# EAGLE design bela_cape (EAGLE 6.5.0)

## Sheet 1 of 4
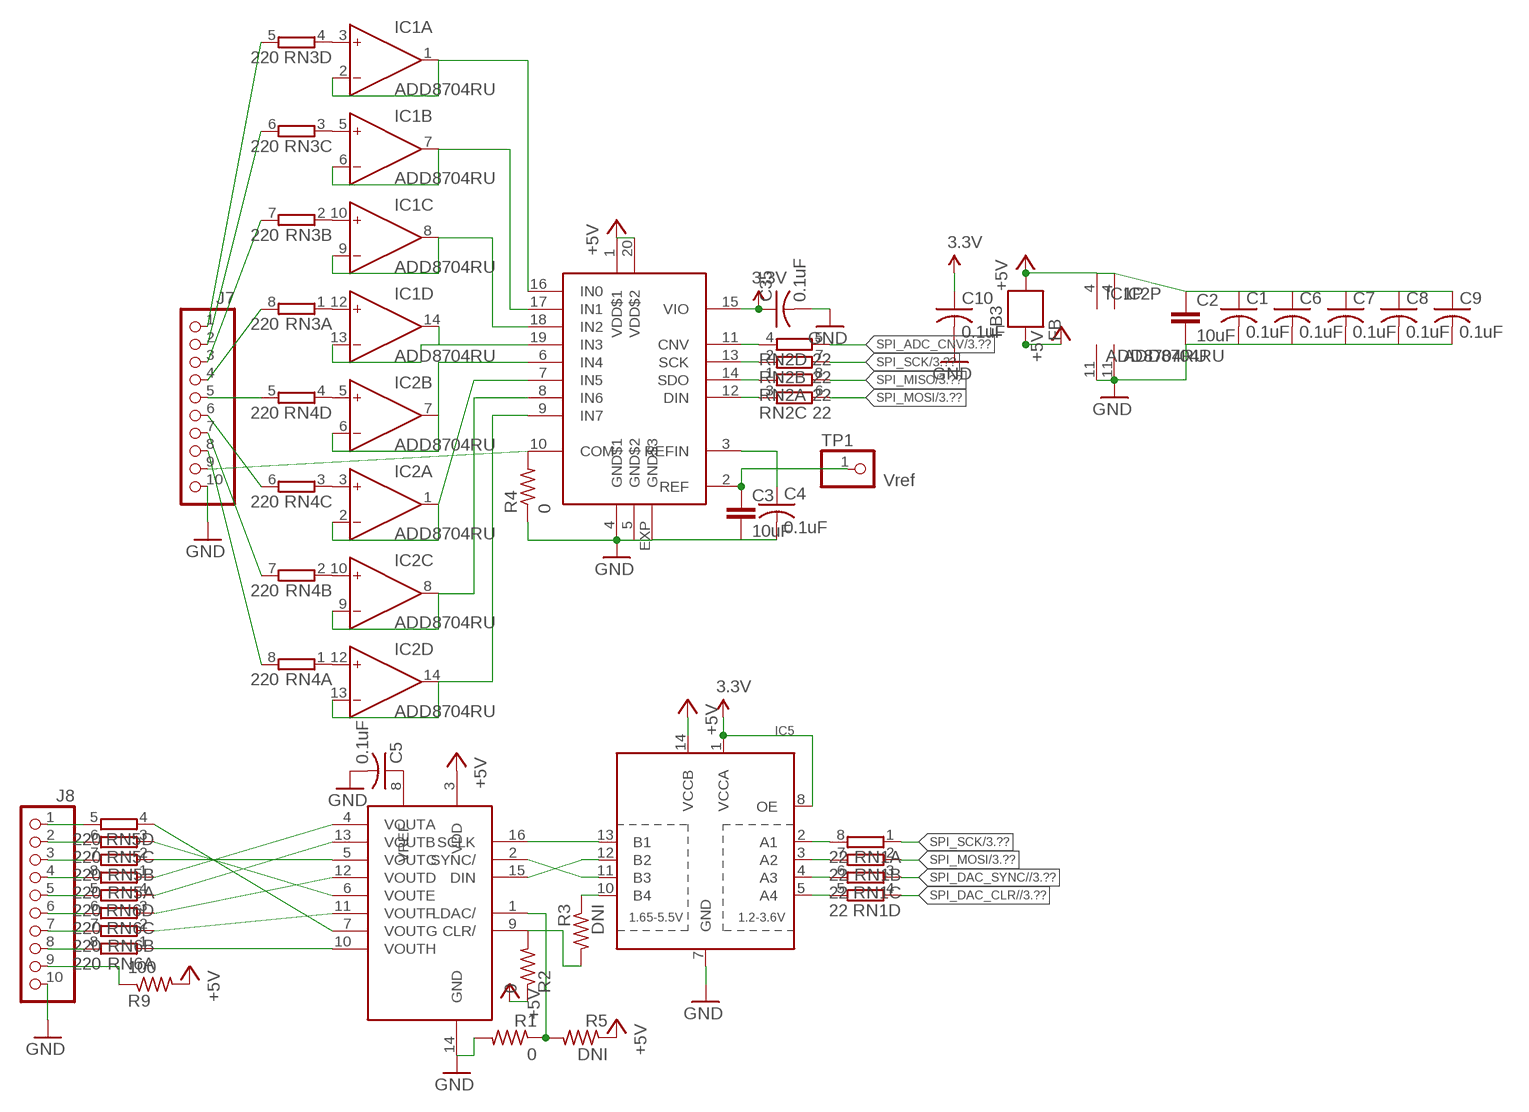
[diagram p0: schematic, sheet 1]

### Parts
C1  0.1uF  C-USC0603  [C0603]
C2  10uF  CAP0603-CAP  [0603-CAP]
C3  10uF  CAP0603-CAP  [0603-CAP]
C4  0.1uF  C-USC0603  [C0603]
C5  0.1uF  C-USC0603  [C0603]
C6  0.1uF  C-USC0603  [C0603]
C7  0.1uF  C-USC0603  [C0603]
C8  0.1uF  C-USC0603  [C0603]
C9  0.1uF  C-USC0603  [C0603]
C10  0.1uF  C-USC0603  [C0603]
C35  0.1uF  C-USC0603  [C0603]
FB3  FB  [0603]
IC1  ADD8704RU  [TSSOP14]
IC2  ADD8704RU  [TSSOP14]
IC3  AD5668  [TSSOP16-PW]
IC4  AD7699  [LFCSP20-LEADS]
IC5  TXB0104PWR  [TSSOP14]
J7  PINHD-1X10  [1X10]
J8  PINHD-1X10  [1X10]
R1  0  R-US_R0603  [R0603]
R2  0  R-US_R0603  [R0603]
R3  DNI  R-US_R0603  [R0603]
R4  0  R-US_R0603  [R0603]
R5  DNI  R-US_R0603  [R0603]
R9  100  R-US_R0603  [R0603]
RN1  22  4R-N0603-ARC  [0603-ARC]
RN2  22  4R-N0603-ARC  [0603-ARC]
RN3  220  4R-N0603-ARC  [0603-ARC]
RN4  220  4R-N0603-ARC  [0603-ARC]
RN5  220  4R-N0603-ARC  [0603-ARC]
RN6  220  4R-N0603-ARC  [0603-ARC]
TP1  PINHD-1X1  [1X01]

### Nets
3.3V: C10.1 C35.1 IC4.15(VIO) IC5.1(VCCA) IC5.8(OE) ; also sheet 3,4
+5V_ADC_DAC: C1.1 C2.1 C6.1 C7.1 C8.1 C9.1 FB3.1 IC1.4(P:V+) IC2.4(P:V+) IC3.3(VDD) IC4.1(VDD$1) IC4.20(VDD$2) IC5.14(VCCB) R2.1 R5.1 R9.2 ; supply symbol labelled +5V
+5V_SYS: FB3.2 ; supply symbol labelled +5V ; also sheet 3
DGND: C1.2 C2.2 C3.2 C4.2 C5.2 C6.2 C7.2 C8.2 C9.2 C10.2 C35.2 IC1.11(P:V-) IC2.11(P:V-) IC3.14(GND) IC4.4(GND$1) IC4.5(GND$2) IC4.EXP(GND$3) IC5.7(GND) J7.10 J8.10 R1.2 R4.1 ; supply symbol labelled GND ; also sheet 3,4
N$1: IC3.16(SCLK) IC5.13(B1)
N$2: IC3.15(DIN) IC5.12(B2)
N$3: IC3.2(SYNC/) IC5.11(B3)
N$4: IC3.9(CLR/) R2.2 R3.2
N$5: IC1.1(A:OUT) IC1.2(A:IN-) IC4.16(IN0)
N$6: IC1.6(B:IN-) IC1.7(B:OUT) IC4.17(IN1)
N$7: IC1.8(C:OUT) IC1.9(C:IN-) IC4.18(IN2)
N$8: IC1.13(D:IN-) IC1.14(D:OUT) IC4.19(IN3)
N$9: IC2.1(A:OUT) IC2.2(A:IN-) IC4.7(IN5)
N$10: IC2.6(B:IN-) IC2.7(B:OUT) IC4.6(IN4)
N$11: IC2.8(C:OUT) IC2.9(C:IN-) IC4.8(IN6)
N$12: IC2.13(D:IN-) IC2.14(D:OUT) IC4.9(IN7)
N$13: IC5.10(B4) R3.1
N$14: IC4.11(CNV) RN2.4
N$15: C5.1 IC3.8(VREF)
N$16: IC5.2(A1) RN1.8
N$17: IC5.3(A2) RN1.7
N$18: IC5.4(A3) RN1.6
N$19: IC5.5(A4) RN1.5
N$20: IC4.12(DIN) RN2.3
N$21: C3.1 IC4.2(REF) TP1.1
N$22: C4.1 IC4.3(REFIN)
N$23: IC4.13(SCK) RN2.2
N$24: IC4.14(SDO) RN2.1
N$25: IC4.10(COM) J7.9 R4.2
N$27: IC1.3(A:IN+) RN3.4
N$29: IC1.5(B:IN+) RN3.3
N$30: IC1.10(C:IN+) RN3.2
N$31: IC1.12(D:IN+) RN3.1
N$32: IC2.5(B:IN+) RN4.4
N$33: IC2.3(A:IN+) RN4.3
N$34: IC2.10(C:IN+) RN4.2
N$35: IC2.12(D:IN+) RN4.1
N$36: IC3.1(LDAC/) R1.1 R5.2
N$37: J7.1 RN3.5
N$38: J7.2 RN3.6
N$39: J7.3 RN3.7
N$40: J7.4 RN3.8
N$41: J7.5 RN4.5
N$42: J7.6 RN4.6
N$43: J7.7 RN4.7
N$44: J7.8 RN4.8
N$45: IC3.7(VOUTG) RN5.4
N$46: IC3.6(VOUTE) RN5.3
N$47: IC3.5(VOUTC) RN5.2
N$48: IC3.4(VOUTA) RN5.1
N$49: IC3.13(VOUTB) RN6.4
N$50: IC3.12(VOUTD) RN6.3
N$51: IC3.11(VOUTF) RN6.2
N$52: J8.8 RN6.8
N$61: J8.9 R9.1
N$72: IC3.10(VOUTH) RN6.1
N$73: J8.7 RN6.7
N$74: J8.6 RN6.6
N$75: J8.5 RN6.5
N$76: J8.4 RN5.8
N$77: J8.3 RN5.7
N$78: J8.2 RN5.6
N$79: J8.1 RN5.5
SPI_ADC_CNV: RN2.5 ; also sheet 3
SPI_DAC_CLR/: RN1.4 ; also sheet 3
SPI_DAC_SYNC/: RN1.3 ; also sheet 3
SPI_MISO: RN2.8 ; also sheet 3
SPI_MOSI: RN1.2 RN2.6 ; also sheet 3
SPI_SCK: RN1.1 RN2.7 ; also sheet 3

### Notes on the sheet
- Vref

## Sheet 2 of 4
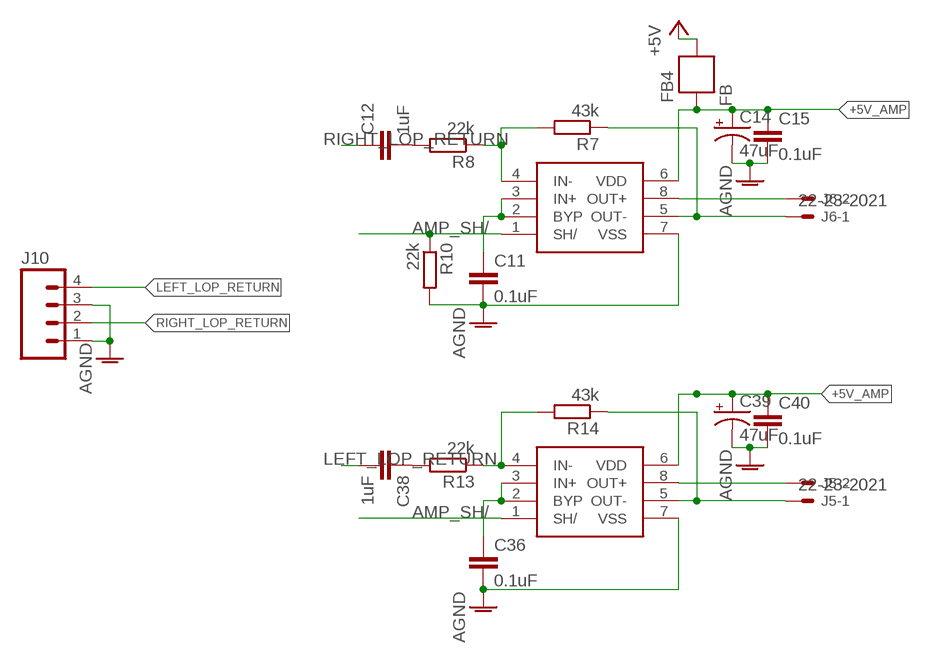
[diagram p1: schematic, sheet 2]

### Parts
C11  0.1uF  C-EUC0603  [C0603]
C12  1uF  C-EUC0603  [C0603]
C14  47uF  CAP_POL1206  [EIA3216]
C15  0.1uF  C-EUC0603  [C0603]
C36  0.1uF  C-EUC0603  [C0603]
C38  1uF  C-EUC0603  [C0603]
C39  47uF  CAP_POL1206  [EIA3216]
C40  0.1uF  C-EUC0603  [C0603]
FB4  FB  [0603]
IC8  LM4876  [SO8]
IC9  LM4876  [SO8]
J5  22-23-2021  [22-23-2021]
J6  22-23-2021  [22-23-2021]
J10  M04PTH  [1X04]
R7  43k  R-EU_R0603  [R0603]
R8  22k  R-EU_R0603  [R0603]
R10  22k  R-EU_R0603  [R0603]
R13  22k  R-EU_R0603  [R0603]
R14  43k  R-EU_R0603  [R0603]

### Nets
+5V_AMP: C14.A(+) C15.1 C39.A(+) C40.1 FB4.2 IC8.6(VDD) IC9.6(VDD) ; also sheet 4
+5V_POW: FB4.1 ; supply symbol labelled +5V ; also sheet 3
AGND: C11.2 C14.C(-) C15.2 C36.2 C39.C(-) C40.2 IC8.7(VSS) IC9.7(VSS) J10.1 J10.3 R10.2 ; also sheet 3
AMP_SH/: IC8.1(SH/) IC9.1(SH/) R10.1 ; also sheet 3
LEFT_LOP_RETURN: C38.2 J10.4
N$26: IC9.4(IN-) R13.1 R14.2
N$28: IC8.4(IN-) R7.2 R8.1
N$53: C11.1 IC8.2(BYP) IC8.3(IN+)
N$55: C12.2 R8.2
N$57: IC8.5(OUT-) J6.1 R7.1
N$60: C36.1 IC9.2(BYP) IC9.3(IN+)
N$64: C38.1 R13.2
N$65: IC9.5(OUT-) J5.1 R14.1
N$67: IC9.8(OUT+) J5.2
N$71: IC8.8(OUT+) J6.2
RIGHT_LOP_RETURN: C12.1 J10.2

## Sheet 3 of 4
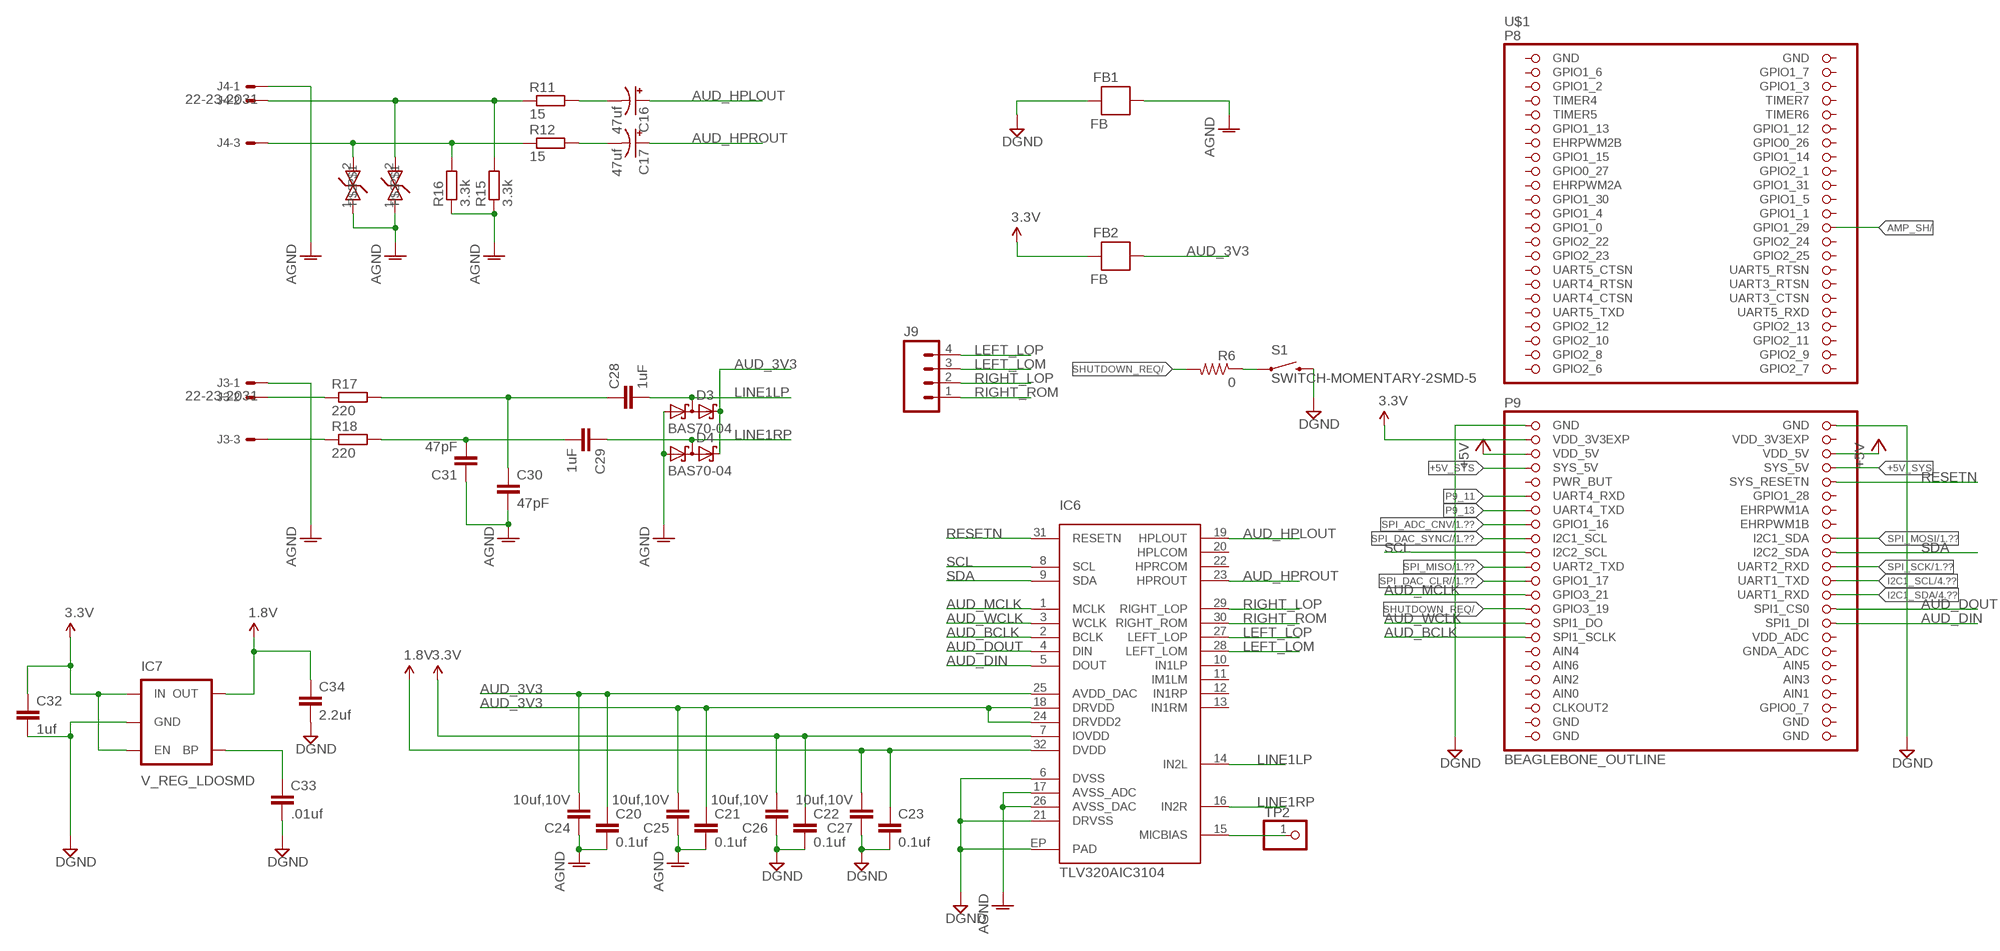
[diagram p2: schematic, sheet 3]

### Parts
C16  47uf  CAP_POL1206  [EIA3216]
C17  47uf  CAP_POL1206  [EIA3216]
C20  0.1uf  C-EUC0603  [C0603]
C21  0.1uf  C-EUC0603  [C0603]
C22  0.1uf  C-EUC0603  [C0603]
C23  0.1uf  C-EUC0603  [C0603]
C24  10uf,10V  CAP0603-CAP  [0603-CAP]
C25  10uf,10V  CAP0603-CAP  [0603-CAP]
C26  10uf,10V  CAP0603-CAP  [0603-CAP]
C27  10uf,10V  CAP0603-CAP  [0603-CAP]
C28  1uF  C-EUC0603  [C0603]
C29  1uF  C-EUC0603  [C0603]
C30  47pF  C-EUC0603  [C0603]
C31  47pF  C-EUC0603  [C0603]
C32  1uf  C-EUC0603  [C0603]
C33  .01uf  C-EUC0603  [C0603]
C34  2.2uf  C-EUC0603  [C0603]
D1  PGB0010603MR  [0603]
D2  PGB0010603MR  [0603]
D3  BAS70-04  [SOT23]
D4  BAS70-04  [SOT23]
FB1  FB  [0603]
FB2  FB  [0603]
IC6  TLV320AIC3104  [QFN-32]
IC7  V_REG_LDOSMD  [SOT23-5]
J3  22-23-2031  [22-23-2031]
J4  22-23-2031  [22-23-2031]
J9  M04PTH  [1X04]
R6  0  R-US_R0603  [R0603]
R11  15  R-EU_R0603  [R0603]
R12  15  R-EU_R0603  [R0603]
R15  3.3k  R-EU_R0603  [R0603]
R16  3.3k  R-EU_R0603  [R0603]
R17  220  R-EU_R0603  [R0603]
R18  220  R-EU_R0603  [R0603]
S1  SWITCH-MOMENTARY-2SMD-5  [TACTILE_SWITCH_SMD-4]
TP2  PINHD-1X1  [1X01]
U$1  BEAGLEBONE_OUTLINE  [BEAGLEBONE_SHIELD]

### Nets
1.8V: C23.1 C27.2 C34.1 IC6.32(DVDD) IC7.5(OUT)
3.3V: C22.1 C26.2 C32.1 FB2.2 IC6.7(IOVDD) IC7.1(IN) IC7.3(EN) U$1.49(VDD_3V3EXP) ; also sheet 1,4
+5V_POW: U$1.51(VDD_5V) U$1.52(VDD_5V) ; supply symbol labelled +5V ; also sheet 2
+5V_SYS: U$1.53(SYS_5V) U$1.54(SYS_5V) ; also sheet 1
AGND: C20.2 C21.2 C24.1 C25.1 C30.2 C31.1 D1.1 D2.1 D3.1(A1) D4.1(A1) FB1.1 IC6.17(AVSS_ADC) IC6.26(AVSS_DAC) J3.1 J4.1 R15.1 R16.1 ; also sheet 2
AMP_SH/: U$1.26(GPIO1_29) ; also sheet 2
AUD_3V3: C20.1 C21.1 C24.2 C25.2 D3.2(C2) D4.2(C2) FB2.1 IC6.18(DRVDD) IC6.24(DRVDD2) IC6.25(AVDD_DAC)
AUD_BCLK: IC6.2(BCLK) U$1.77(SPI1_SCLK)
AUD_DIN: IC6.5(DOUT) U$1.76(SPI1_DI)
AUD_DOUT: IC6.4(DIN) U$1.74(SPI1_CS0)
AUD_HPLOUT: C16.A(+) IC6.19(HPLOUT)
AUD_HPROUT: C17.A(+) IC6.23(HPROUT)
AUD_MCLK: IC6.1(MCLK) U$1.71(GPIO3_21)
AUD_WCLK: IC6.3(WCLK) U$1.75(SPI1_DO)
AUDIO_INL: C28.1 C30.1 R17.2
AUDIO_INR: C29.2 C31.2 R18.2
DGND: C22.2 C23.2 C26.1 C27.1 C32.2 C33.2 C34.2 FB1.2 IC6.6(DVSS) IC6.21(DRVSS) IC6.EP(PAD) IC7.2(GND) S1.4 U$1.47(GND) U$1.48(GND) ; also sheet 1,4
HPL: D2.2 J4.2 R11.1 R15.2
HPR: D1.2 J4.3 R12.1 R16.2
I2C1_SCL: U$1.70(UART1_TXD) ; also sheet 4
I2C1_SDA: U$1.72(UART1_RXD) ; also sheet 4
LEFT_LOM: IC6.28(LEFT_LOM) J9.3
LEFT_LOP: IC6.27(LEFT_LOP) J9.4
LINE1LP: C28.2 D3.3(C1A2) IC6.14(IN2L)
LINE1RP: C29.1 D4.3(C1A2) IC6.16(IN2R)
N$54: C16.C(-) R11.2
N$56: IC6.15(MICBIAS) TP2.1
N$58: R6.1 S1.1
N$59: C17.C(-) R12.2
N$62: J3.2 R17.1
N$63: C33.1 IC7.4(BP)
N$66: J3.3 R18.1
P9_11: U$1.57(UART4_RXD)
P9_13: U$1.59(UART4_TXD)
RESETN: IC6.31(RESETN) U$1.56(SYS_RESETN)
RIGHT_LOP: IC6.29(RIGHT_LOP) J9.2
RIGHT_ROM: IC6.30(RIGHT_ROM) J9.1
SCL: IC6.8(SCL) U$1.65(I2C2_SCL)
SDA: IC6.9(SDA) U$1.66(I2C2_SDA)
SHUTDOWN_REQ/: R6.2 U$1.73(GPIO3_19)
SPI_ADC_CNV: U$1.61(GPIO1_16) ; also sheet 1
SPI_DAC_CLR/: U$1.69(GPIO1_17) ; also sheet 1
SPI_DAC_SYNC/: U$1.63(I2C1_SCL) ; also sheet 1
SPI_MISO: U$1.67(UART2_TXD) ; also sheet 1
SPI_MOSI: U$1.64(I2C1_SDA) ; also sheet 1
SPI_SCK: U$1.68(UART2_RXD) ; also sheet 1
Unconnected: IC6.10(IN1LP) IC6.11(IM1LM) IC6.12(IN1RP) IC6.13(IN1RM) IC6.20(HPLCOM) IC6.22(HPRCOM) U$1.3(GPIO1_6) U$1.4(GPIO1_7) U$1.5(GPIO1_2) U$1.6(GPIO1_3) U$1.7(TIMER4) U$1.8(TIMER7) U$1.9(TIMER5) U$1.10(TIMER6) U$1.11(GPIO1_13) U$1.12(GPIO1_12) U$1.13(EHRPWM2B) U$1.14(GPIO0_26) U$1.15(GPIO1_15) U$1.16(GPIO1_14) U$1.17(GPIO0_27) U$1.18(GPIO2_1) U$1.19(EHRPWM2A) U$1.20(GPIO1_31) U$1.21(GPIO1_30) U$1.22(GPIO1_5) U$1.23(GPIO1_4) U$1.24(GPIO1_1) U$1.25(GPIO1_0) U$1.27(GPIO2_22) U$1.28(GPIO2_24) U$1.29(GPIO2_23) U$1.30(GPIO2_25) U$1.31(UART5_CTSN) U$1.32(UART5_RTSN) U$1.33(UART4_RTSN) U$1.34(UART3_RTSN) U$1.35(UART4_CTSN) U$1.36(UART3_CTSN) U$1.37(UART5_TXD) U$1.38(UART5_RXD) U$1.39(GPIO2_12) U$1.40(GPIO2_13) U$1.41(GPIO2_10) U$1.42(GPIO2_11) U$1.43(GPIO2_8) U$1.44(GPIO2_9) U$1.45(GPIO2_6) U$1.46(GPIO2_7) U$1.55(PWR_BUT) U$1.58(GPIO1_28) U$1.60(EHRPWM1A) U$1.62(EHRPWM1B) U$1.78(VDD_ADC) U$1.79(AIN4) U$1.80(GNDA_ADC) U$1.81(AIN6) U$1.82(AIN5) U$1.83(AIN2) U$1.84(AIN3) U$1.86(AIN1) U$1.87(CLKOUT2) U$1.88(GPIO0_7)

## Sheet 4 of 4
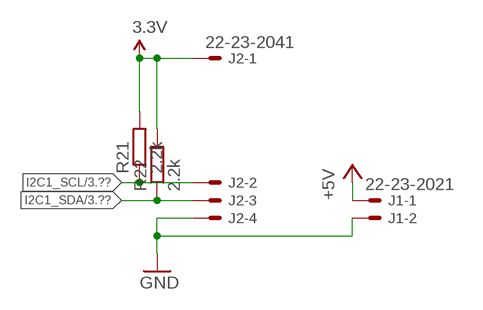
[diagram p3: schematic, sheet 4]

### Parts
J1  22-23-2021  [22-23-2021]
J2  22-23-2041  [22-23-2041]
R21  2.2k  R-EU_R0603  [R0603]
R22  2.2k  R-EU_R0603  [R0603]

### Nets
3.3V: J2.1 R21.2 R22.2 ; also sheet 1,3
+5V_AMP: J1.1 ; supply symbol labelled +5V ; also sheet 2
DGND: J1.2 J2.4 ; supply symbol labelled GND ; also sheet 1,3
I2C1_SCL: J2.2 R21.1 ; also sheet 3
I2C1_SDA: J2.3 R22.1 ; also sheet 3

## Power pins joined to a net without a drawn wire
AIN0: U$1.85(AIN0)
DGND: U$1.1(GND) U$1.2(GND) U$1.89(GND) U$1.90(GND) U$1.91(GND) U$1.92(GND)
VDD_3V3EXP: U$1.50(VDD_3V3EXP)

## Library data of the parts
C1 C4-C10 C35 = rcl:C-US: CAPACITOR, American symbol
C2 C3 = SparkFun-Passives:CAP: Capacitor Standard 0603 ceramic capacitor, and 0.1" leaded capacitor.
C11 C12 C15 C36 C38 C40 = rcl:C-EU: CAPACITOR, European symbol
C14 C39 = SparkFun-Capacitors:CAP_POL: Capacitor Polarized These are standard SMD and PTH capacitors. Normally 10uF, 47uF, and 100uF in electrolytic and tantalum varieties. Always verify the external diameter of the through hole cap, it varies with capacity, voltage, and manufacturer. The EIA devices should be standard.
C16 C17 = SparkFun-Capacitors:CAP_POL: Capacitor Polarized These are standard SMD and PTH capacitors. Normally 10uF, 47uF, and 100uF in electrolytic and tantalum varieties. Always verify the external diameter of the through hole cap, it varies with capacity, voltage, and manufacturer. The EIA devices should be standard.; MANEX: 123-0001196
C20-C23 = rcl:C-EU: CAPACITOR, European symbol; MANEX: 123-0001056
C24-C27 = SparkFun-Passives:CAP: Capacitor Standard 0603 ceramic capacitor, and 0.1" leaded capacitor.; MANEX: 123-0001127
C28 C29 C33 = rcl:C-EU: CAPACITOR, European symbol; MANEX: 123-0001032
C30 C31 = rcl:C-EU: CAPACITOR, European symbol; MANEX: 123-0001115
C32 = rcl:C-EU: CAPACITOR, European symbol; MANEX: 123-0001087
C34 = rcl:C-EU: CAPACITOR, European symbol; MANEX: 123-0001094
D1 D2 = CircuitCo:PGB0010603MR; MANEX: 130-0001371
D3 D4 = diode:BAS70-04: Silicon Schottky Diodes General-purpose diode for high-speed switching
FB1 FB2 = SparkFun-Passives:FB; MANEX: 126-0001418
FB3 FB4 = SparkFun-Passives:FB
IC1 IC2 = analog-devices:ADD8704: 16 V Quad Operational Amplifier Source: Ananlog Devices .. 780914713ADD8704_0.pdf; MF: ALTERA CORPORATION; MPN: ADD8704ARUZ-REEL; OC_FARNELL: unknown; OC_NEWARK: 59K0964
IC3 = custom:AD5668
IC4 = custom:AD7699
IC5 = SparkFun-DigitalIC:TXB0104PWR: 4-Bit Bi-Directional Level Shifter 1.2V-3.6V (VCCA) to 1.65V-5.5V (VCCB) bi-directional level shifter with auto direction sensing. Max data rate - VCCA 1.8V: 20Mbps (50ns), VCCA 3.3V: 100Mbps (10ns) Digikey: 296-21929-1-ND (TSSOP) IC-11329
IC6 = CircuitCo:TLV320AIC3104; MANEX: 140-0004277
IC7 = SparkFun-PowerIC:V_REG_LDO: Voltage Regulator LDO Standard 150mA LDO voltage regulator in SOT-23 layout. Micrel part MIC5205. BP (by-pass) pin is used to lower output noise with 470pF cap.; MANEX: 140-0001616
IC8 IC9 = custom:LM4876
J1 J5 J6 = con-molex:22-23-2021: .100" (2.54mm) Center Header - 2 Pin; MF: MOLEX; MPN: 22-23-2021; OC_FARNELL: 1462926; OC_NEWARK: 25C3832
J2 = con-molex:22-23-2041: .100" (2.54mm) Center Header - 4 Pin; MF: MOLEX; MPN: 22-23-2041; OC_FARNELL: 1462920; OC_NEWARK: 38C0355
J3 J4 = con-molex:22-23-2031: .100" (2.54mm) Center Header - 3 Pin; MF: MOLEX; MPN: 22-23-2031; OC_FARNELL: 1462950; OC_NEWARK: 30C0862
J7 J8 = pinhead:PINHD-1X10: PIN HEADER
J9 J10 = SparkFun-Connectors:M04: Header 4 Standard 4-pin 0.1" header. Use with straight break away headers (SKU : PRT-00116), right angle break away headers (PRT-00553), swiss pins (PRT-00743), machine pins (PRT-00117), and female headers (PRT-00115). Molex polarized connector foot print use with SKU : PRT-08231 with associated crimp pins and housings. 1MM SMD Version SKU: PRT-10208; MANEX: 258-0002845
R1-R6 R9 = rcl:R-US_: RESISTOR, American symbol
R7 R8 R10 R13 R14 R21 R22 = rcl:R-EU_: RESISTOR, European symbol
R11 R12 R15-R18 = rcl:R-EU_: RESISTOR, European symbol; MANEX: 110-0002014
RN1-RN6 = resistor-dil:4R-N: Array Chip Resistor Source: RS Component / Phycomp; OC_FARNELL: unknown; OC_NEWARK: unknown
S1 = custom:SWITCH-MOMENTARY-2: Various NO switches- pushbuttons, reed, etc
TP1 TP2 = pinhead:PINHD-1X1: PIN HEADER
U$1 = adafruit:BEAGLEBONE_OUTLINE: Should match A3 pinout - but not completely tested

## Board
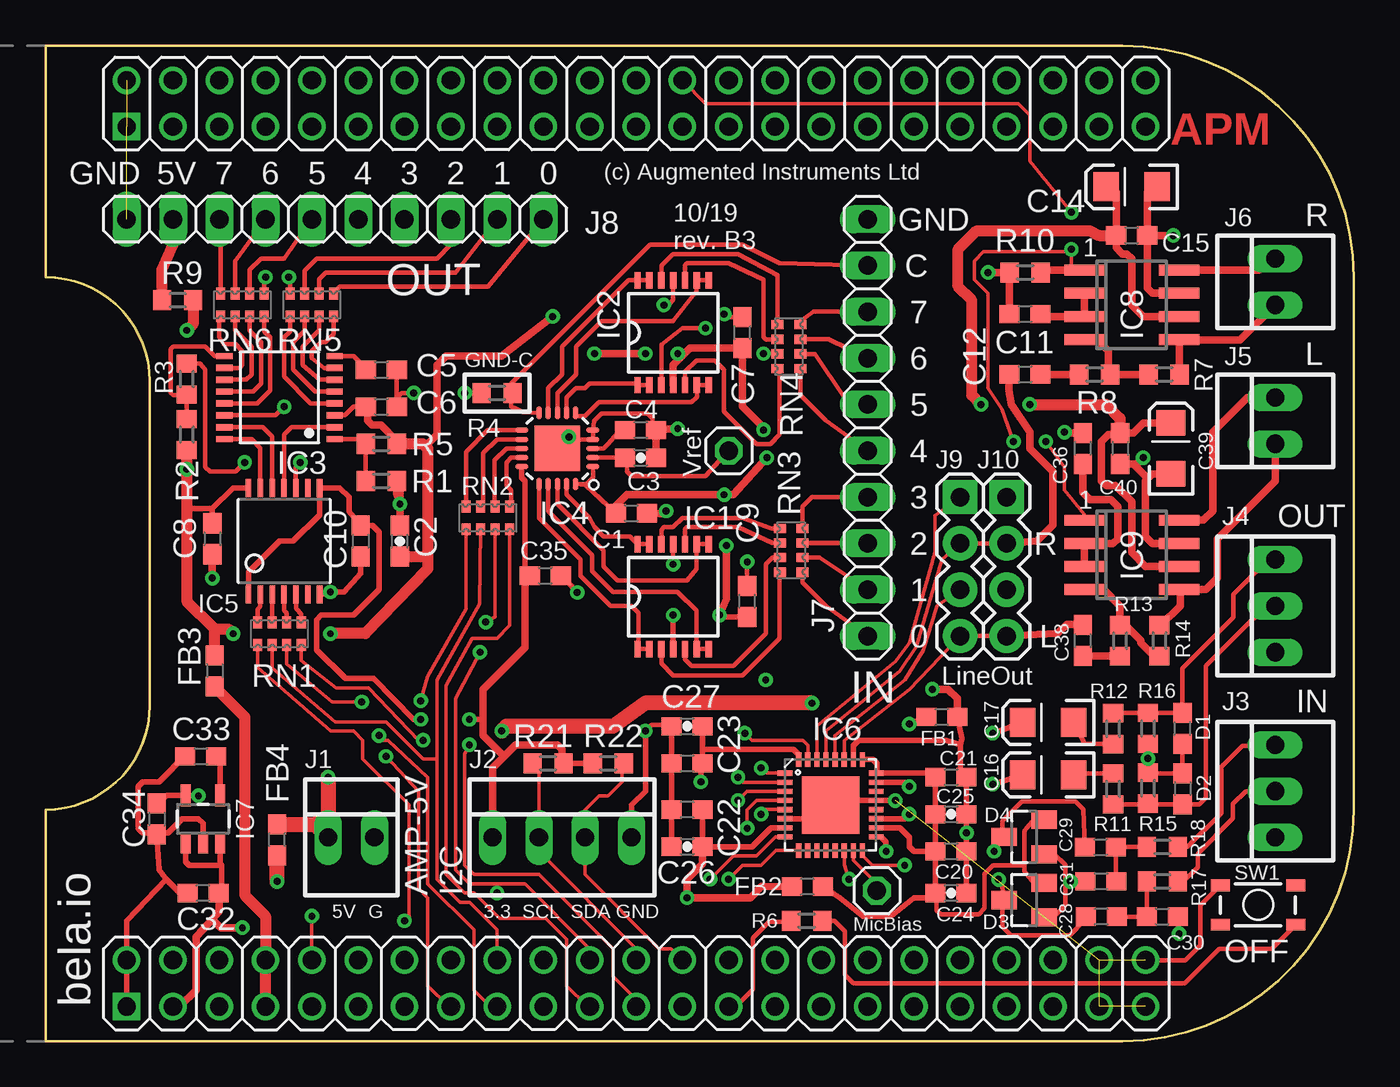
[diagram p4: board, top side]
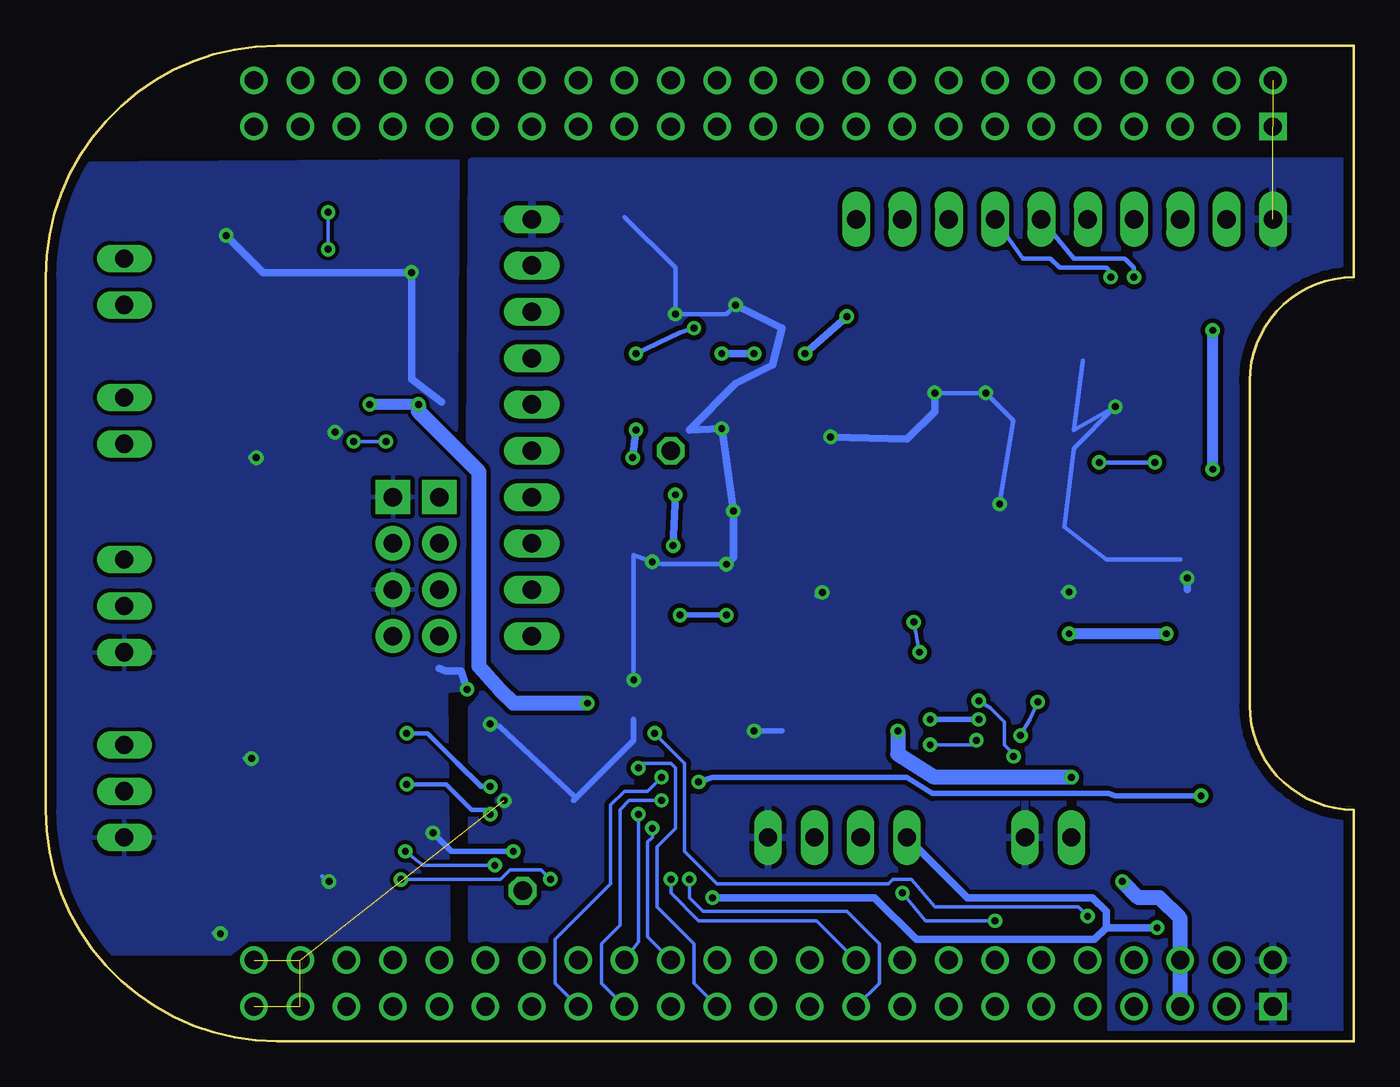
[diagram p5: board, bottom side, seen from below]

Size 71.75 x 54.61 mm. Coordinates in mm from the lower left corner, seen from the top.
Copper layers (1*16): Top 0.035mm / dielectric 1.5mm / Bottom 0.035mm
Design rules "default *": minimum track width 8mil, minimum drill 15mil, track to track 7mil, track to pad 7mil, pad to pad 7mil, via to via 7mil, smd to smd 0mil, copper to edge 20mil, drill to drill 8mil, minimum pad ring 10mil, minimum via ring 8mil, stop-mask expansion 4mil, vias tented up to drill 20mil, thermal gap 10mil

### Footprints (pad centres in the part's own frame; a part is rotated, then mirrored left to right if it is on the bottom)
C0603 = smd 1.1 x 1: 1 -0.85,0; 2 0.85,0
0603-CAP = smd 1.1 x 1: 1 -0.85,0; 2 0.85,0
EIA3216 = smd 1.4 x 1.6: A 1.4,0; C -1.4,0
0603 = smd 1.1 x 1: 1 -0.85,0; 2 0.85,0
SOT23 = smd 1 x 1.4: 1 -0.95,-1.1; 2 0.95,-1.1; 3 0,1.1
TSSOP14 = smd 0.9 x 0.35: 1 -2.875,1.95; 2 -2.875,1.3; 3 -2.875,0.65; 4 -2.875,0; 5 -2.875,-0.65; 6 -2.875,-1.3; 7 -2.875,-1.95; 8 2.875,-1.95; 9 2.875,-1.3; 10 2.875,-0.65; 11 2.875,0; 12 2.875,0.65; 13 2.875,1.3; 14 2.875,1.95
TSSOP16-PW = smd 0.35 x 0.9: 1 -2.275,-3.025; 2 -1.625,-3.025; 3 -0.975,-3.025; 4 -0.325,-3.025; 5 0.325,-3.025; 6 0.975,-3.025; 7 1.625,-3.025; 8 2.275,-3.025; 9 2.275,3.025; 10 1.625,3.025; 11 0.975,3.025; 12 0.325,3.025; 13 -0.325,3.025; 14 -0.975,3.025; 15 -1.625,3.025; 16 -2.275,3.025
LFCSP20-LEADS = smd 0.7 x 0.3: 1 -1.95,1; 2 -1.95,0.5; 3 -1.95,0; 4 -1.95,-0.5; 5 -1.95,-1; 11 1.95,-1; 12 1.95,-0.5; 13 1.95,0; 14 1.95,0.5; 15 1.95,1 | smd 0.3 x 0.7: 6 -1,-1.95; 7 -0.5,-1.95; 8 0,-1.95; 9 0.5,-1.95; 10 1,-1.95; 16 1,1.95; 17 0.5,1.95; 18 0,1.95; 19 -0.5,1.95; 20 -1,1.95 | smd 2.5 x 2.5: EXP 0,0
TSSOP14' = smd 0.305 x 0.991: 1 -1.95,-2.918; 2 -1.3,-2.918; 3 -0.65,-2.918; 4 0,-2.918; 5 0.65,-2.918; 6 1.3,-2.918; 7 1.95,-2.918; 8 1.95,2.918; 9 1.3,2.918; 10 0.65,2.918; 11 0,2.918; 12 -0.65,2.918; 13 -1.3,2.918; 14 -1.95,2.918
QFN-32 = smd 0.285 x 0.8: 1 -1.75,-2.5; 2 -1.25,-2.5; 3 -0.75,-2.5; 4 -0.25,-2.5; 5 0.25,-2.5; 6 0.75,-2.5; 7 1.25,-2.5; 8 1.75,-2.5; 17 1.75,2.5; 18 1.25,2.5; 19 0.75,2.5; 20 0.25,2.5; 21 -0.25,2.5; 22 -0.75,2.5; 23 -1.25,2.5; 24 -1.75,2.5 | smd 0.8 x 0.285: 9 2.5,-1.75; 10 2.5,-1.25; 11 2.5,-0.75; 12 2.5,-0.25; 13 2.5,0.25; 14 2.5,0.75; 15 2.5,1.25; 16 2.5,1.75; 25 -2.5,1.75; 26 -2.5,1.25; 27 -2.5,0.75; 28 -2.5,0.25; 29 -2.5,-0.25; 30 -2.5,-0.75; 31 -2.5,-1.25; 32 -2.5,-1.75 | smd 3.15 x 3.15: EP 0,0
SOT23-5 = smd 0.55 x 1.2: 1 -0.95,-1.3; 2 0,-1.3; 3 0.95,-1.3; 4 0.95,1.3; 5 -0.95,1.3
SO8 = smd 0.6 x 2.2: 1 -1.905,-2.6; 2 -0.635,-2.6; 3 0.635,-2.6; 4 1.905,-2.6; 5 1.905,2.6; 6 0.635,2.6; 7 -0.635,2.6; 8 -1.905,2.6
22-23-2021 = drill 1 long: 1 -1.27,0; 2 1.27,0
22-23-2041 = drill 1 long: 1 -3.81,0; 2 -1.27,0; 3 1.27,0; 4 3.81,0
22-23-2031 = drill 1 long: 1 -2.54,0; 2 0,0; 3 2.54,0
1X10 = drill 1.016 long: 1 -11.43,0; 2 -8.89,0; 3 -6.35,0; 4 -3.81,0; 5 -1.27,0; 6 1.27,0; 7 3.81,0; 8 6.35,0; 9 8.89,0; 10 11.43,0
1X04 = drill 1.016 pad 1.88 square: 1 0,0 | drill 1.016 pad 1.88: 2 2.54,0; 3 5.08,0; 4 7.62,0
R0603 = smd 1 x 1.1: 1 -0.85,0; 2 0.85,0
0603-ARC = smd 0.5 x 0.65: 1 -1.2,-0.625; 2 -0.4,-0.625; 3 0.4,-0.625; 4 1.2,-0.625; 5 1.2,0.625; 6 0.4,0.625; 7 -0.4,0.625; 8 -1.2,0.625
TACTILE_SWITCH_SMD-4 = smd 1.05 x 0.65: 1 -2.075,1.075; 2 2.075,1.075; 3 -2.075,-1.075; 4 2.075,-1.075
1X01 = drill 1.016 octagon: 1 0,0
BEAGLEBONE_SHIELD = drill 1 square: 1 4.445,19.05; 47 52.705,19.05 | drill 1: 2 1.905,19.05; 3 4.445,21.59; 4 1.905,21.59; 5 4.445,24.13; 6 1.905,24.13; 7 4.445,26.67; 8 1.905,26.67; 9 4.445,29.21; 10 1.905,29.21; 11 4.445,31.75; 12 1.905,31.75; 13 4.445,34.29; 14 1.905,34.29; 15 4.445,36.83; 16 1.905,36.83; 17 4.445,39.37; 18 1.905,39.37; 19 4.445,41.91; 20 1.905,41.91; 21 4.445,44.45; 22 1.905,44.45; 23 4.445,46.99; 24 1.905,46.99; 25 4.445,49.53; 26 1.905,49.53; 27 4.445,52.07; 28 1.905,52.07; 29 4.445,54.61; 30 1.905,54.61; 31 4.445,57.15; 32 1.905,57.15; 33 4.445,59.69; 34 1.905,59.69; 35 4.445,62.23; 36 1.905,62.23; 37 4.445,64.77; 38 1.905,64.77; 39 4.445,67.31; 40 1.905,67.31; 41 4.445,69.85; 42 1.905,69.85; 43 4.445,72.39; 44 1.905,72.39; 45 4.445,74.93; 46 1.905,74.93; 48 50.165,19.05; 49 52.705,21.59; 50 50.165,21.59; 51 52.705,24.13; 52 50.165,24.13; 53 52.705,26.67; 54 50.165,26.67; 55 52.705,29.21; 56 50.165,29.21; 57 52.705,31.75; 58 50.165,31.75; 59 52.705,34.29; 60 50.165,34.29; 61 52.705,36.83; 62 50.165,36.83; 63 52.705,39.37; 64 50.165,39.37; 65 52.705,41.91; 66 50.165,41.91; 67 52.705,44.45; 68 50.165,44.45; 69 52.705,46.99; 70 50.165,46.99; 71 52.705,49.53; 72 50.165,49.53; 73 52.705,52.07; 74 50.165,52.07; 75 52.705,54.61; 76 50.165,54.61; 77 52.705,57.15; 78 50.165,57.15; 79 52.705,59.69; 80 50.165,59.69; 81 52.705,62.23; 82 50.165,62.23; 83 52.705,64.77; 84 50.165,64.77; 85 52.705,67.31; 86 50.165,67.31; 87 52.705,69.85; 88 50.165,69.85; 89 52.705,72.39; 90 50.165,72.39; 91 52.705,74.93; 92 50.165,74.93

### Placement (x,y rotation side)
C1  32.13,28.96 0 top
C2  19.43,27.43 90 top
C3  32.64,32 0 top
C4  32.64,33.53 0 top
C5  18.41,36.83 0 top
C6  18.41,34.8 0 top
C7  38.23,38.86 90 top
C8  9.14,27.56 270 top
C9  38.48,24.13 90 top
C10  17.27,27.43 270 top
C11  53.72,39.88 180 top
C12  53.72,36.58 0 top
C14  59.56,46.86 180 top
C15  59.56,44.2 0 top
C16  54.99,14.6 180 top
C17  54.99,17.49 180 top
C20  49.66,10.41 0 top
C21  49.66,14.48 0 top
C22  35.18,12.7 180 top
C23  35.18,15.24 180 top
C24  49.66,8.13 180 top
C25  49.66,12.45 180 top
C26  35.18,10.67 0 top
C27  35.18,17.27 0 top
C28  57.9,6.84 180 top
C29  57.85,10.64 0 top
C30  61.24,6.84 0 top
C31  57.88,8.76 0 top
C32  8.64,8.13 180 top
C33  8.51,15.62 180 top
C34  6.1,12.19 270 top
C35  27.41,25.53 0 top
C36  56.9,32.51 90 top
C38  56.9,21.97 90 top
C39  61.72,32.51 90 top
C40  58.93,32.51 270 top
D1  62.36,17.15 90 top
D2  62.36,13.84 270 top
D3  53.67,7.74 90 top
D4  53.67,11.21 90 top
FB1  49.15,17.78 180 top
FB2  41.78,8.47 180 top
FB3  9.27,20.32 270 top
FB4  12.7,11.05 90 top
IC1  34.42,24.38 90 top
IC2  34.42,38.86 90 top
IC3  12.83,35.31 90 top
IC4  28.07,32.51 180 top
IC5  [TSSOP14']  13.08,27.43 0 top
IC6  43.05,12.95 270 top
IC7  8.64,12.19 0 top
IC8  59.56,40.39 270 top
IC9  59.56,26.67 270 top
J1  16.76,11.18 0 top
J2  28.32,11.18 0 top
J3  67.44,13.72 90 top
J4  67.44,23.88 90 top
J5  67.44,34.04 90 top
J6  67.44,41.66 90 top
J7  45.09,33.66 90 top
J8  15.88,45.09 180 top
J9  50.16,29.84 270 top
J10  52.7,29.84 270 top
R1  18.41,30.73 0 top
R2  7.75,33.27 90 top
R3  7.75,36.32 270 top
R4  24.77,35.56 0 top
R5  18.41,32.77 180 top
R6  41.75,6.6 180 top
R7  61.34,36.58 180 top
R8  57.53,36.58 180 top
R9  7.24,40.64 0 top
R10  53.72,42.16 180 top
R11  58.55,13.84 90 top
R12  58.55,17.15 270 top
R13  58.93,21.97 270 top
R14  61.09,21.97 270 top
R15  60.46,13.88 270 top
R16  60.46,17.16 90 top
R17  61.24,8.76 180 top
R18  61.24,10.65 180 top
R21  27.56,15.24 0 top
R22  30.86,15.24 180 top
RN1  12.83,22.35 0 top
RN2  24.26,28.7 180 top
RN3  40.89,26.92 270 top
RN4  40.77,38.1 270 top
RN5  14.61,40.39 0 top
RN6  10.8,40.39 0 top
S1  66.5,7.47 180 top
TP1  37.47,32.38 0 top
TP2  45.59,8.25 0 top
U$1  -14.61,54.61 270 top

### Tracks (layer width: path | path; a pad name or v marks a point on that pad's centre or on a via)
1.8V  (via drill 0.38)
  Top 0.305: C27.2 36.03,16 | 36.03,16 C23.1 35.94,15.15 v35.94,14.22 | IC6.32 41.3,15.72 41.02,16 36.03,16 | C34.1 6.67,13.49 IC7.5 7.84,13.49 v8.38,13.46
  Bottom 0.305: v8.38,13.46 13.08,13.46 13.46,13.59 23.11,13.59 24.51,14.48 35.18,14.48 v35.94,14.22
3.3V  (via drill 0.38)
  Top 0.305: IC6.7 39.77,11.7 38.73,10.67 C26.2 C22.1 | IC7.1 7.69,9.84 7.87,9.65 9.65,9.65 | IC7.3 9.59,9.72 9.65,9.65 | R22.2 R21.2 28.32,15.33 | IC5.1 11.13,25.74 12.83,27.43 13.59,27.43 15.03,28.87 IC5.8 16.13,30.35 16.64,29.84 16.64,29.04 C10.1 17.95,28.28 18.29,27.94 18.29,24.77 16.89,23.37 15.11,23.37 14.86,23.11 14.86,21.46 16.46,19.9 17.99,19.9 20.19,17.65 v20.57,17.65 | IC4.15 26.12,30.91 26.29,30.73 26.29,25.02 26.3,25.62 | 9.53,8.04 9.53,8.09 C32.1 9.65,8.29 9.65,9.65 | v23.24,17.65 23.88,17.65 24,17.78
  Top 0.406: U$1.49 7.37,1.91 8.26,2.79 8.26,5.72 8.99,6.52 | 8.99,6.52 9.15,6.7 | 9.15,6.7 9.53,7.11 9.53,8.04 | FB2.2 39.26,8.48 38.66,7.87 v35.18,7.87 35.18,8.89 36.03,9.74 C26.2 | 9.49,7.87 C32.1 | J2.1 24.51,14.99 25.15,15.62 | 25.15,15.62 25.78,16.26 28.07,16.26 28.32,16 28.32,15.33 | 26.29,25.02 26.29,21.59 24,19.3 24,17.78 24,16.76 25.15,15.62 | C35.1 26.3,25.62 | 9.15,6.7 9.15,6.68 | 9.15,6.68 8.99,6.52 | v10.8,6.22 9.6,6.22 9.15,6.68
  Bottom 0.305: v20.57,17.65 v23.24,17.65
  Bottom 0.406: v35.18,7.87 26.29,7.87 24,5.59 14.22,5.59 13.59,6.22 | J2.1 21.21,7.87 14.35,7.87 13.59,7.11 13.59,6.22 | 13.59,6.22 v10.8,6.22
+5V_ADC_DAC  (via drill 0.38, 0.38 pad 0.41)
  Top 0.254: C1.1 29.6,30.51 IC4.20 29.67,30.56 30.02,30.91 IC4.1 | 8.09,32.42 R2.1 | IC3.3 16.42,34.33 16.89,34.8 C6.1 17.65,34.71 | R5.1 19.27,32.93
  Top 0.305: C9.1 37.05,23.28 v36.96,23.37 | v34.42,23.37 IC1.4 | IC5.14 10.28,30.35 9.14,29.21 | 9.14,29.21 C8.1 | 9.14,29.21 7.87,29.21 7.75,29.34
  Top 0.406: 19.27,32.93 18.41,33.78 17.91,33.78 17.65,34.04 17.65,34.71 | 34.8,37.47 35.34,38.01 C7.1 38.23,34.8 39.24,33.78 v39.37,33.53 | 34.8,37.47 34.42,37.08 IC2.4 | C1.1 31.28,29.38 31.88,29.97 v37.21,29.97 37.72,29.97 v39.56,32 | C9.1 38.57,23.37 | 20.96,32.51 20.96,32.77 21.46,33.27 21.46,37.08 21.97,37.59 25.02,37.59 v27.81,39.75 | v32.89,37.72 v30.1,37.72 | v36.96,23.37 37.34,24.26 v37.34,27.18 | 34.8,37.47 v34.67,37.72
  Top 0.61: v15.62,22.35 17.53,22.35 20.96,25.91 20.96,26.42 | R5.1 20.7,32.77 20.96,32.51 20.96,26.42 | R2.1 7.71,32.42 v7.75,31.37 7.75,29.34 7.75,24.13 9.27,22.61 | R9.2 8.09,39.33 v7.75,38.99 | C2.1 20.87,26.58 20.96,26.42 | FB3.1 9.27,22.61 | 9.27,22.61 10.03,22.61 v10.29,22.35
  Bottom 0.305: v36.96,23.37 v34.42,23.37
  Bottom 0.406: v39.37,33.53 v39.56,32 | v37.21,29.97 v37.34,27.18 | v34.67,37.72 v32.89,37.72 | v30.1,37.72 v27.81,39.75
  Bottom 0.61: v15.62,22.35 v10.29,22.35 | v7.75,31.37 v7.75,38.99
+5V_AMP  (via drill 0.38)
  Top 0.406: C15.1 58.71,43.52 59.05,43.18 59.31,43.18 59.56,42.93 59.56,40.39 60.2,39.75 IC8.6 | C15.1 58.71,46.57 58.55,46.74 C14.A | 58.46,44.45 C15.1 | IC9.6 60.33,26.04 59.56,26.8 59.56,29.59 58.67,30.48 58.17,30.48 57.91,30.73 57.91,32.89 58.29,33.27 58.84,33.27 C40.1 59.65,33.36 60.2,33.91 C39.A
  Top 0.61: C15.1 57.79,44.2 57.28,44.45 51.05,44.45 50.04,43.43 50.04,41.4 50.8,40.64 50.8,35.43 v51.31,34.92 | v53.98,34.92 58.17,34.92 58.93,34.16 C40.1
  Top 0.813: v42.04,18.54 32.89,18.54 31.12,17.27 25.27,17.27 v25.02,17.02 | v15.49,14.48 J1.1 14.77,11.9 FB4.2
  Bottom 0.254: 46.86,19.3 46.86,19.05
  Bottom 0.61: v51.31,34.92 v53.98,34.92
  Bottom 0.813: v42.04,18.54 46.1,18.54 46.86,19.3 48.01,20.57 48.01,31.24 51.31,34.54 v51.31,34.92 | v25.02,17.02 25.02,15.75 22.99,14.48 v15.49,14.48
+5V_POW  (via drill 0.38)
  Top 0.813: v12.7,8.76 FB4.1
  Bottom 0.813: U$1.51 U$1.52 9.53,6.73 10.67,7.87 11.81,7.87 v12.7,8.76
+5V_SYS
  Top 0.61: U$1.53 U$1.54 12.07,6.86 10.92,8 10.92,17.78 9.27,19.43 FB3.2
AGND  (via drill 0.38)
  Top 0.254: D1.1 D2.1 60.46,14.69 | 60.46,14.69 R15.1 | R15.1 | R15.1 R16.1 | 60.46,14.69 | 60.46,14.69 v60.46,15.5 | C30.2 62.09,5.97 v62.17,5.89 | D3.1 55.26,6.79 55.93,7.47 55.93,8.85 | 55.93,8.85 55.93,9.68 55.33,10.23 54.7,10.23 D4.1 | 55.93,8.85 55.97,8.76 56.53,8.76 v56.21,8.76 56.54,8.76 C31.1
  Top 0.305: IC6.26 44.3,16.24 44.58,16.51 49.4,16.51 50.16,16.26 | 50.16,16.26 50.16,14.57 C21.2 C25.1 C20.2 v50.51,11.43 C24.1 | IC6.17 45.82,11.2 46.1,10.92 v46.1,10.41 | FB1.1 50.25,16.6 50.16,16.26
  Top 0.406: FB1.1 50,18.8 49.49,19.3 v48.64,19.3 | C11.2 R10.2 v51.69,42.16 | C15.2 60.41,41.31 60.71,41.02 IC8.7 | C15.2 60.41,46.57 60.83,46.74 C14.C | v61.85,44.2 C15.2 | IC9.7 60.71,27.3 60.33,27.69 60.33,30.73 60.45,30.86 | C39.C 60.7,31.11 60.45,30.86 | 60.45,30.86 59.65,31.66 C40.2 59.86,31.66 v60.2,32 | C36.2 55.92,33.36 v55.88,33.4
  Bottom 0.254: v60.46,15.5 60.83,15.5 | v62.17,5.89 62.49,5.89 62.54,5.94 | v56.21,8.76 56.53,8.99 56.58,9.04
  Bottom 0.305: v46.1,10.41 49.49,10.41 v50.51,11.43
  Bottom 0.406: v61.85,44.2 59.82,42.16 v51.69,42.16 51.69,36.32 50.04,35.05 | 50.16,20.45 49.78,20.32 48.96,20.32 v48.64,19.3 | v55.88,33.4 55.63,33.4 | v60.2,32 60.45,32
  pour Bottom (isolate 0.203): 49.66,5.59 60.58,5.59 61.59,4.83 71.5,4.83 70.99,48.13 49.15,48.26 49.28,31.5 48.77,30.99 48.9,20.32 48.9,19.3 49.78,19.18
AMP_SH/  (via drill 0.38)
  Top 0.203: v56.26,45.47 53.98,48.26 53.98,50.8 53.34,51.44 36.2,51.44 U$1.26 | 56.26,42.29 v56.26,43.43 56.13,43.31 51.44,43.31 50.93,42.8 50.93,41.78 51.69,41.02 51.69,35.81 52.45,34.67 v53.09,32.89 | IC9.1 56.96,28.89 55.88,30.23 55.88,31.5 v54.86,32.89
  Top 0.406: IC8.1 56.26,42.29 54.7,42.29 R10.1
  Bottom 0.203: v56.26,45.47 v56.26,43.43 | v54.86,32.89 v53.09,32.89
AUD_3V3
  Top 0.254: D3.2 54.2,8.69 53.69,9.31 53.69,9.63 | D4.2 54.56,12.04 54.09,12.04 53.69,11.53 53.69,9.63 | 53.69,9.63 51.96,9.63 51.5,9.17 51.5,7.28 51.18,6.96 49.1,6.96 48.87,7.19 48.87,8.07 C24.2
  Top 0.305: FB2.1 43.56,7.87 44.83,6.86 46.36,6.86 47.62,7.87 48.3,7.87 C24.2 C20.1 | C20.1 C25.2 C21.1 48.33,14.7 IC6.24 45.59,14.74 45.59,15.24 45.38,15.45 IC6.25 | IC6.18 46.84,11.7 47.37,11.18 47.37,10.67 47.62,10.41 C20.1
AUD_BCLK  (via drill 0.38)
  Top 0.203: IC6.2 38.25,14.2 v37.97,14.48
  Bottom 0.203: v37.97,14.48 38.73,13.72 40.01,13.72 40.77,12.95 40.77,8.64 43.81,5.59 43.81,3.17 U$1.77
AUD_DIN  (via drill 0.38)
  Top 0.203: IC6.5 39.5,12.7 v39.24,12.45
  Bottom 0.203: v39.24,12.45 39.24,5.46 U$1.76
AUD_DOUT  (via drill 0.38)
  Top 0.203: IC6.4 38.98,13.2 38.48,12.7 v38.48,11.68
  Bottom 0.203: v38.48,11.68 38.48,11.18 38.73,10.92 38.73,5.72 U$1.74
AUD_HPLOUT  (via drill 0.38)
  Top 0.305: IC6.19 47.13,12.2 v47.37,12.45 | v51.94,14.1 C16.A
  Bottom 0.254: 47.37,12.7 48.39,12.7 49.78,14.1 v51.94,14.1
  Bottom 0.305: v47.37,12.45 47.37,12.7
AUD_HPROUT  (via drill 0.38)
  Top 0.305: IC6.23 47.14,14.2 v47.37,13.97 | v51.94,16.89 C17.A
  Bottom 0.254: 49.15,15.24 50.8,16.89 v51.94,16.89
  Bottom 0.305: v47.37,13.97 47.88,13.97 49.15,15.24
AUD_MCLK  (via drill 0.38)
  Top 0.203: IC6.1 39.52,14.7 v39.24,14.99
  Bottom 0.203: v39.24,14.99 38.99,15.24 37.47,15.24 37.21,14.99 37.21,11.68 38.23,10.67 38.23,7.37 36.2,5.33 36.2,3.17 U$1.71
AUD_WCLK  (via drill 0.38)
  Top 0.203: IC6.3 38.47,13.7 v37.97,13.21
  Bottom 0.203: v37.97,13.21 39.75,13.21 40.26,12.7 40.26,6.35 41.27,5.33 41.27,3.17 U$1.75
AUDIO_INL
  Top 0.254: R17.2 C30.1 58.66,6.83 C28.1
AUDIO_INR
  Top 0.254: R18.2 58.62,10.65 C29.2 58.7,8.79 C31.2
DGND  (via drill 0.38, 0.38 pad 0.41)  (6 unrouted)
  Top 0.254: IC4.EXP 28.57,33.01 IC4.4 IC4.5 30.07,34.01 30.48,34.42 33.02,34.42 33.27,34.16 33.27,33.57 C4.2 | 19.27,35.31 C5.2 | 19.27,35.31 C6.2 | R1.2 19.43,30.57 | IC3.14 12.61,34.33 v13.08,34.8 | v22.99,35.56 R4.1 | v20.19,35.56 19.52,35.56 19.27,35.31 | C7.2 37.38,39.71 v37.21,39.88 | v33.91,40.39 34.16,40.39 34.42,40.64 IC2.11 | v38.48,26.29 C9.2 | v34.42,26.16 IC1.11 | 34.42,17.36 33.23,17.36 v32.89,17.02 | IC5.7 15.5,24.51 v15.62,24.64 | U$1.92 62.52,4.45 63.32,5.25 63.32,7.44 S1.4
  Top 0.305: IC6.6 42.3,12.2 IC6.EP 43.3,13.2 IC6.21 v46.61,13.2 | C34.2 6.22,9.4 6.6,8.89 | 6.6,8.89 7.37,8.13 C32.2 | IC7.2 8.64,11.94 8.38,12.19 7.49,12.19 6.73,11.43 6.31,11.43 C34.2 | C33.2 7.75,15.75 6.22,14.22 5.33,14.22 5.08,13.97 5.08,11.68 5.33,11.43 6.14,11.43 C34.2 | 6.6,8.89 4.45,6.6 U$1.48 U$1.47 | C26.1 C22.2 C23.2 C27.1 34.42,17.36 | FB1.2 v47.37,17.4 | J2.4 32.13,12.95 32.89,13.72 v32.89,17.02 | C10.2 17.27,25.65 16.38,24.64 v15.62,24.64 | C35.2 28.41,25.46 v29.16,24.61
  Top 0.406: 19.43,30.57 C2.2 | R1.2 19.27,30.06 v19.43,29.46 | IC4.EXP v28.7,33.15 | 33.27,33.57 34.38,33.57 v34.67,33.59 | C1.2 33.91,28.96 v34.04,29.08 | C8.2 v9.14,25.4 | C3.2 C4.2
  Bottom 0.254: 14.86,37.34 15.37,33.53 v13.08,34.8 15.37,32.51 15.88,28.19 13.59,26.42 9.53,26.42 | v22.99,35.56 v20.19,35.56 18.67,34.04 v19.43,29.46 | v33.91,40.39 34.42,39.88 v37.21,39.88 37.21,42.42 40.01,45.21 | v39.5,19.81 39.5,26.67 v38.48,26.29 37.97,26.16 v34.42,26.16 | v15.62,24.64 16,24.64
  Bottom 0.305: 42.8,13.21 42.67,13.34 | 42.67,13.34 39.5,16.51 39.5,17.65 | v47.37,17.4 46.86,17.27 42.67,13.34 | v32.89,17.02 31.37,17.02 | v29.16,24.61 29.44,24.44
  Bottom 0.406: v28.7,33.15 24.51,33.02 22.99,34.54 v22.99,35.56 | v34.42,26.16 34.04,26.54 v34.04,29.08 v34.67,33.59 36.45,33.53 33.91,36.07 31.88,37.08 31.37,39.12 v33.91,40.39 | v9.14,25.4 9.14,24.77
  pour Bottom (isolate 0.254): 48.39,48.26 0.38,48.26 0.38,0.51 13.34,0.51 13.34,7.87 41.02,7.87 41.02,5.59 48.39,5.59 48.39,18.29 48.01,18.67 47.88,30.99 48.51,33.02
HPL
  Top 0.254: J4.2 66.17,23.11 63.63,20.57 63.63,13.34 63.29,12.99 D2.2 60.46,12.99 | R11.1 60.46,12.99 | 60.46,12.99 R15.2
HPR
  Top 0.254: J4.3 66.29,25.65 65.15,24.51 65.15,23.24 62.36,20.45 D1.2 60.41,17.99 | R12.1 60.41,17.99 | 60.41,17.99 R16.2
I2C1_SCL
  Top 0.203: U$1.70 32.39,5.08 27.05,10.41 J2.2 27.05,14.9 R21.1
I2C1_SDA
  Top 0.203: U$1.72 34.29,5.08 33.66,5.08 29.59,9.14 J2.3 29.59,12.7 30.35,13.46 30.86,13.46 31.62,14.22 31.62,15.15 R22.1
LEFT_LOM
  Top 0.203: IC6.28 43.3,16.76 47.12,19.81 48.13,21.46 48.9,23.88 J9.3
LEFT_LOP
  Top 0.203: IC6.27 43.8,16.5 47.37,19.3 J9.4
LEFT_LOP_RETURN
  Top 0.254: J10.4 50.16,22.23
  Top 0.406: C38.2 56.86,22.86 56.01,22.86 55.5,22.35 J10.4
LINE1LP  (via drill 0.38)
  Top 0.203: IC6.14 43.8,9.66 v44.07,8.89
  Top 0.254: C28.2 56.96,6.6 56.16,5.8 52.93,5.8 52.47,6.26 52.47,7.73 D3.3 52.48,8.47 v52.27,8.87
  Bottom 0.203: v44.07,8.89 44.58,9.4 46.29,9.4 46.8,8.89 50.29,8.89 v52.27,8.87
LINE1RP  (via drill 0.38)
  Top 0.203: IC6.16 44.8,10.19 45.34,9.65 v47.12,9.65
  Top 0.254: v52.02,10.41 52.02,10.75 D4.3 52.47,11.21 52.47,12.08 53.53,13.15 56.49,13.15 56.91,12.72 C29.1
  Bottom 0.203: v47.12,9.65 51.05,9.65 v52.02,10.41
N$1
  Top 0.254: IC3.16 11.29,33.03 11.78,32.54 IC5.13
N$2
  Top 0.254: IC3.15 11.91,33.68 12.43,33.16 IC5.12
N$3
  Top 0.254: IC3.2 13.49,33.68 13.08,33.27 IC5.11
N$4
  Top 0.254: R2.2 R3.2 7.71,35.43 6.99,35.43 6.86,35.56 6.86,37.97 6.99,38.1 8.76,38.1 9.28,37.58 IC3.9
N$5
  Top 0.254: IC1.2 IC1.1 32.51,21.55 32.51,23.49 32.13,23.88 30.99,23.88 29.34,25.53 29.34,26.42 27.07,28.69 IC4.16
N$6
  Top 0.254: IC4.17 27.57,29.08 29.97,26.67 29.97,25.78 31.12,24.64 34.67,24.64 35.69,23.62 35.69,21.54 IC1.6 IC1.7
N$7
  Top 0.254: IC4.18 28.07,29.46 30.61,26.92 30.61,26.04 31.37,25.27 35.18,25.27 35.69,25.91 35.69,27.23 IC1.9 IC1.8
N$8
  Top 0.254: IC4.19 28.57,29.98 29.85,28.7 30.1,28.19 30.61,27.69 32.04,27.69 IC1.14 IC1.13
N$9
  Top 0.254: IC2.2 IC2.1 | IC2.1 32.47,36.24 | IC4.7 28.57,35.3 29.08,35.81 29.59,35.81 29.85,36.07 32.39,36.07 IC2.1
N$10
  Top 0.254: IC2.7 IC2.6 35.72,35.34 35.43,35.05 30.35,35.05 29.59,34.29 29.1,34.29 IC4.6
N$11
  Top 0.254: IC4.8 28.07,35.56 29.08,36.58 29.08,38.1 30.48,39.5 34.42,39.5 35.69,41.15 35.69,41.71 IC2.9 IC2.8
N$12
  Top 0.254: IC2.13 IC2.14 31.96,41.74 28.32,38.1 28.32,36.58 27.56,35.81 27.56,34.27 IC4.9
N$13  (via drill 0.38)
  Top 0.254: R3.1 8.47,37.17 8.76,36.83 8.76,31.5 9.02,31.24 10.41,31.24 v10.92,31.75 | v13.97,31.75 13.72,31.5 13.72,30.37 IC5.10
  Bottom 0.254: v10.92,31.75 v13.97,31.75
N$14
  Top 0.254: IC4.11 24.24,33.51 23.06,32.33 RN2.4
N$15
  Top 0.254: C5.1 17.57,36.92 16.89,37.59 15.86,37.59 IC3.8
N$16
  Top 0.254: IC5.2 11.78,23.85 11.63,23.69 RN1.8
N$17
  Top 0.254: 12.5,23.05 RN1.7 IC5.3
N$18
  Top 0.254: 13.15,23.05 RN1.6 13.23,23.48 13.08,23.62 IC5.4
N$19
  Top 0.254: IC5.5 13.73,23.73 14.03,23.44 RN1.5
N$20
  Top 0.254: IC4.12 24.76,33.01 24,32.26 24,29.47 RN2.3
N$21
  Top 0.254: IC4.2 31.74,32.01 C3.1 31.88,31.92 31.88,31.24 32.13,30.99 36.2,30.99 TP1.1
N$22
  Top 0.254: IC4.3 30.61,32.51 30.86,32.77 31.37,33.36 C4.1
N$23
  Top 0.254: IC4.13 25.27,32.51 24.64,31.88 24.64,29.31 RN2.2
N$24
  Top 0.254: IC4.14 25.54,32.01 25.27,31.75 25.27,30.48 25.53,30.23 25.53,29.4 RN2.1
N$25
  Top 0.254: IC4.10 26.19,34.52 25.53,34.8 25.53,35.47 R4.2 25.53,35.65 25.53,36.07 33.15,43.69 38.23,43.69 40.26,42.67 J7.9
N$26
  Top 0.406: R14.2 60.79,21.12 60.07,21.84 60.07,21.97 59.22,22.82 R13.1 58.93,23.88 58.04,24.77 IC9.4
N$27
  Top 0.254: IC1.3 33.77,20.72 34.42,20.07 38.23,20.07 40.26,22.1 RN3.4
N$28
  Top 0.406: IC8.4 57.66,38.48 58.29,37.85 58.29,36.66 | R8.1 R7.2
  Top 0.61: R8.1 58.29,36.66
N$29
  Top 0.254: IC1.5 35.07,20.94 35.43,20.57 37.72,20.57 39.5,22.35 39.5,26.16 39.86,26.52 RN3.3
N$30
  Top 0.254: IC1.10 35.07,28.08 35.18,28.19 37.97,28.19 39.86,27.32 RN3.2
N$31
  Top 0.254: IC1.12 33.77,28.05 33.91,28.19 34.42,28.19 34.92,28.7 38.23,28.7 39.82,28.12 RN3.1
N$32
  Top 0.254: IC2.5 35.07,36.72 35.69,37.34 36.7,37.34 37.21,36.83 37.21,34.54 38.99,32.77 39.75,32.77 40.26,33.27 40.26,36.78 RN4.4
N$33  (via drill 0.38)
  Top 0.254: IC2.3 33.77,38.21 34.92,39.12 v36.2,39.12 | v39.37,37.72 40.12,37.72 RN4.3
  Bottom 0.254: v36.2,39.12 36.96,38.86 v39.37,37.72
N$34
  Top 0.254: IC2.10 35.07,42.56 35.18,42.67 37.47,42.67 39.37,41.78 39.37,38.61 39.5,38.48 40.12,38.48 RN4.2
N$35
  Top 0.254: IC2.12 33.77,42.53 34.42,43.18 37.97,43.18 40.14,42.03 RN4.1
N$36
  Top 0.254: IC3.1 17.3,33.03 R5.2 R1.1
N$37
  Top 0.254: RN3.5 41.52,25.16 42.8,23.88 J7.1
N$38
  Top 0.254: RN3.6 42.44,26.52 J7.2
N$39
  Top 0.254: RN3.7 44.47,27.32 J7.3
N$40
  Top 0.254: RN3.8 41.52,29.33 42.04,29.84 J7.4
N$41
  Top 0.254: RN4.5 41.39,35.44 42.8,34.04 J7.5
N$42
  Top 0.254: RN4.6 42.18,37.7 43.81,35.31 J7.6
N$43
  Top 0.254: RN4.7 42.95,38.5 J7.7
N$44
  Top 0.254: RN4.8 41.39,39.49 42.1,40.01 J7.8
N$45
  Top 0.254: IC3.7 15.27,36.93 14.61,37.47 14.61,37.85 15.11,38.35 15.37,38.35 15.81,38.79 RN5.4
N$46
  Top 0.254: IC3.6 15.03,36.28 14.1,37.08 14.1,38.1 15.01,39.01 RN5.3
N$47
  Top 0.254: IC3.5 14.79,35.63 13.59,36.83 13.59,38.35 14.21,38.97 RN5.2
N$48
  Top 0.254: IC3.4 14.55,34.98 13.08,36.45 13.08,38.61 13.41,38.93 RN5.1
N$49
  Top 0.254: IC3.13 11.61,34.98 12.32,35.69 12.32,38.61 12,38.93 RN6.4
N$50
  Top 0.254: IC3.12 11.37,35.63 11.81,36.07 11.81,38.35 11.2,38.97 RN6.3
N$51
  Top 0.254: IC3.11 11.01,36.28 11.3,36.58 11.3,38.1 10.4,39.01 RN6.2
N$52
  Top 0.254: RN6.8 9.6,44.27 J8.8
N$53
  Top 0.406: C11.1 54.7,39.75 IC8.3 IC8.2
N$54
  Top 0.254: R11.2 56.99,14.69 C16.C
N$55
  Top 0.406: R8.2 C12.2
N$56
  Top 0.203: IC6.15 44.3,9.93 45.34,8.89 45.34,8.51 TP2.1
N$57
  Top 0.406: R7.1 62.19,38.45 | 62.19,38.45 IC8.5 | 62.19,38.45 65.5,38.45 J6.1
N$58
  Top 0.254: R6.1 43.26,6.6 43.83,6.03 43.83,3.63 44.3,3.17 62.49,3.17 64.38,5.06 67.24,5.06 S1.1
N$59
  Top 0.254: R12.2 56.99,16.3 C17.C
N$60
  Top 0.406: IC9.3 IC9.2 58.55,27.3 58.8,27.56 58.8,29.34 58.42,29.72 57.28,29.72 56.9,30.1 C36.1
N$61
  Top 0.61: R9.1 6.39,42.33 6.99,43.69 J8.9
N$62
  Top 0.254: R17.1 62.4,8.76 63.18,9.54 63.18,10.28 65.12,12.22 65.12,13.01 65.81,13.7 67.42,13.7 J3.2
N$63
  Top 0.305: IC7.4 9.59,15.39 C33.1
N$64
  Top 0.406: R13.2 C38.1
N$65
  Top 0.406: R14.1 61.18,22.82 62.23,23.88 62.23,24.7 IC9.5 63.63,24.77 64.26,25.4 64.26,27.56 67.44,30.73 J5.1
N$66
  Top 0.254: R18.1 62.63,10.65 64.48,12.5 64.48,15.04 65.63,16.19 67.37,16.19 J3.3
N$67
  Top 0.406: IC9.8 63.5,28.58 64.01,29.08 64.01,33.4 65.91,35.31 J5.2
N$71
  Top 0.406: IC8.8 66.55,42.29 J6.2
N$72
  Top 0.254: IC3.10 10.64,36.93 10.8,37.08 10.8,37.85 10.41,38.23 9.78,38.23 9.53,38.61 9.53,39.69 RN6.1
N$73
  Top 0.254: RN6.7 10.4,42.78 J8.7
N$74
  Top 0.254: RN6.6 11.2,42.31 11.81,42.93 13.08,42.93 J8.6
N$75  (via drill 0.38)
  Top 0.254: RN6.5 12,41.84 v12.07,41.91
  Bottom 0.254: v12.07,41.91 12.07,42.42 12.57,42.93 15.37,42.93 J8.5
N$76  (via drill 0.38)
  Top 0.254: RN5.8 13.41,41.84 v13.34,41.91
  Bottom 0.254: v13.34,41.91 13.34,42.16 13.59,42.42 16.13,42.42 16.64,42.93 18.16,42.93 J8.4
N$77
  Top 0.254: RN5.7 14.21,42.27 14.86,42.93 21.46,42.93 22.23,43.69 J8.3
N$78
  Top 0.254: RN5.6 15.01,41.8 15.37,42.16 22.48,42.16 J8.2
N$79
  Top 0.254: RN5.5 15.81,41.08 16.13,41.4 24.26,41.4 J8.1
RESETN  (via drill 0.38)
  Top 0.203: U$1.56 v14.61,6.86 | IC6.31 41.8,16.24 41.53,16.51 38.73,16.51 v38.35,16.89
  Bottom 0.203: v14.61,6.86 15.11,7.37 22.99,7.37 24.26,8.89 25.27,8.89 25.53,8.64 34.92,8.64 36.7,10.41 36.7,15.24 v38.35,16.89
RIGHT_LOP
  Top 0.203: IC6.29 42.8,17.02 46.86,20.32 47.75,21.65 49.15,26.42 J9.2
RIGHT_LOP_RETURN
  Top 0.254: J10.2 50.23,27.3
  Top 0.406: C12.1 52.83,36.54 52.83,35.69 52.96,34.92 53.98,33.4 53.98,32.51 55.25,31.24 55.25,28.32 54.36,27.43 J10.2
RIGHT_ROM
  Top 0.203: IC6.30 42.3,17.28 46.61,20.83 47.37,21.84 48.77,26.8 48.77,28.83 J9.1
SCL  (via drill 0.38)
  Top 0.203: IC6.8 40.03,11.2 38.99,10.16 37.72,10.16 v36.45,8.89
  Bottom 0.203: v36.45,8.89 36.45,7.87 35.69,7.11 27.81,7.11 26.04,5.33 26.04,3.17 U$1.65
SDA  (via drill 0.38)
  Top 0.203: IC6.9 40.05,10.45 39.24,9.65 38.23,9.65 v37.47,8.89
  Bottom 0.203: v37.47,8.89 37.47,8.13 35.94,6.6 29.46,6.6 U$1.66
SHUTDOWN_REQ/
  Top 0.254: U$1.73 37.86,1.91 38.8,2.85 38.8,5.66 39.68,6.54 40.84,6.54 R6.2
SPI_ADC_CNV  (via drill 0.38)
  Top 0.203: RN2.5 23.06,23.72 20.96,20.02 v20.57,18.67 | U$1.61 22.1,1.91 20.96,3.05 20.96,7.87 20.45,8.38 20.45,13.72 v18.67,15.62
  Bottom 0.203: v20.57,18.67 19.94,18.29 19.18,17.53 19.18,16.26 18.67,15.75 v18.67,15.62
SPI_DAC_CLR/  (via drill 0.38)
  Top 0.203: U$1.69 32.39,2.29 31.12,3.56 31.12,5.08 27.05,9.14 23.5,9.14 22.99,9.65 22.99,15.75 v23.24,16.26 | v20.7,16.51 20.45,16.51 17.72,19.37 15.92,19.37 14.03,20.9 RN1.4
  Bottom 0.203: v23.24,16.26 20.96,16.26 v20.7,16.51
SPI_DAC_SYNC/  (via drill 0.38)
  Top 0.203: U$1.63 24.38,1.91 23.5,2.79 23.5,6.1 20.96,8.64 20.96,14.48 18.8,16.51 18.54,16.51 v18.29,16.76 | RN1.3 13.23,20.68 15.71,18.61 v17.34,18.61
  Bottom 0.203: v18.29,16.76 17.78,17.65 v17.34,18.61
SPI_MISO
  Top 0.203: RN2.8 25.46,22.79 24.77,22.1 23.38,22.1 21.97,19.51 21.97,9.14 22.99,8.13 23.5,8.13 24.89,6.73 27.43,6.73 28.58,5.59 28.58,3.05 29.72,1.91 U$1.67
SPI_MOSI
  Top 0.203: RN2.6 23.81,23.98 21.46,19.8 21.46,15.49 | U$1.64 24.77,6.1 23.24,7.62 22.73,7.62 21.46,8.89 21.46,15.49 | RN1.2 12.43,20.47 15.88,17.53 18.67,17.53 20.7,15.49 21.46,15.49
SPI_SCK  (via drill 0.38)
  Top 0.203: RN2.7 24.66,23.26 v24.14,22.99 | U$1.68 29.85,5.08 26.29,8.64 24.77,8.64 | 24.77,8.64 23.24,8.64 22.48,9.4 22.48,18.8 v23.82,21.34 | v23.82,21.34 | RN1.1 11.63,20.5 15.62,17.02 16.89,17.02 17.4,16.51 17.4,15.49 19.94,12.95 19.94,6.86 v19.69,6.6 | v24.77,8.13 24.77,8.64
  Bottom 0.203: v24.14,22.99 v23.82,21.34 | v19.69,6.6 23.5,6.6 v24.77,8.13

### Text on the board
Top: APM
tPlace: GND | 5V | 7 | 6 | 5 | 4 | 3 | 2 | 1 | 0 | (c) Augmented Instruments Ltd | GND | R | 10/19 / rev. B3 | C | 1 | OUT | 7 | 6 | GND-C | L | 5 | 4 | Vref | 3 | 1 | 2 | R | OUT | 1 | 0 | L | IN | LineOut | IN | AMP-5V | I2C | 5V | G | 3.3 | SCL | SDA | GND | MicBias | bela.io
tNames: SW1 | OFF